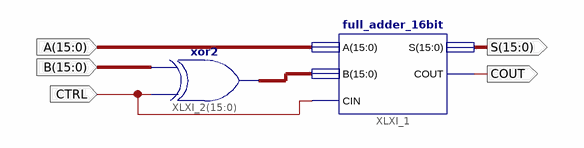
[diagram p0: schematic sheet 1]
// Xilinx ISE schematic full_adder_2s.sch (spartan6) as structural Verilog: 2 symbols, 5 ports
module full_adder_2s (
  input  [15:0] B,
  input  [15:0] A,
  input  CTRL,
  output [15:0] S,
  output COUT
);

  wire [15:0] XLXN_6;

  full_adder_16bit XLXI_1 (.A(A), .B(XLXN_6), .CIN(CTRL), .COUT(COUT), .S(S));
  assign XLXN_6 = {16{CTRL}} ^ B;  // xor2 XLXI_2[15..0], 16 bits wide
endmodule
